# Altium schematic sheet POWER.SchDoc
size A3
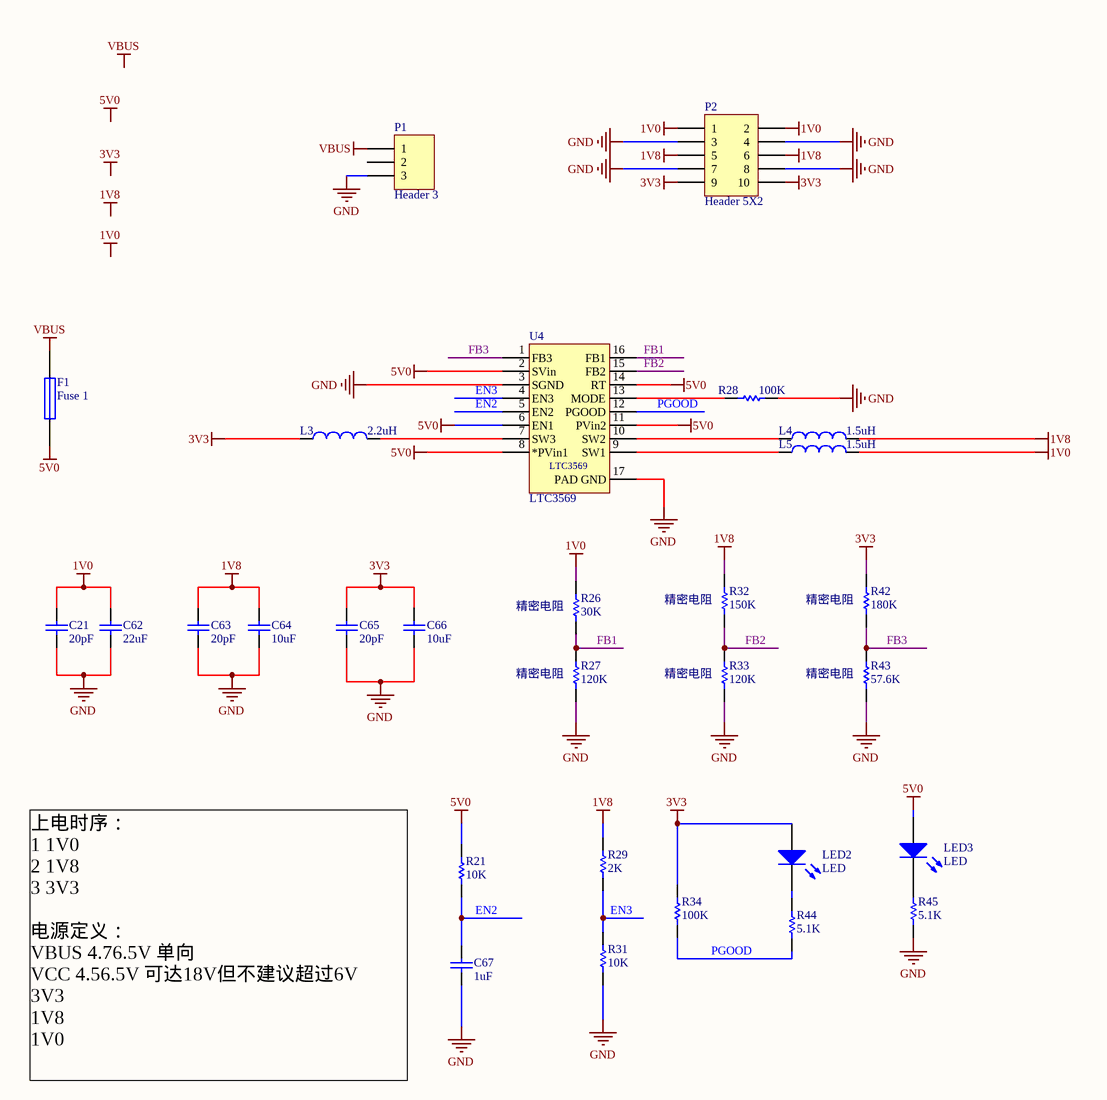
[diagram p0: POWER.SchDoc]

## Parts
C21  value 20pF  [1608[0603]]  (hidden comment: Cap)
C62  value 22uF  [1608[0603]]  (hidden comment: Cap)
C63  value 20pF  [1608[0603]]  (hidden comment: Cap)
C64  value 10uF  [1608[0603]]  (hidden comment: Cap)
C65  value 20pF  [1608[0603]]  (hidden comment: Cap)
C66  value 10uF  [1608[0603]]  (hidden comment: Cap)
C67  value 1uF  [1608[0603]]  (hidden comment: Cap)
F1  Fuse 1  [1206]
L3  value 2.2uH  [C2012]  (hidden comment: Inductor)
L4  value 1.5uH  [C2012]  (hidden comment: Inductor)
L5  value 1.5uH  [C2012]  (hidden comment: Inductor)
LED2  LED  [1608[0603]]
LED3  LED  [1608[0603]]
P1  Header 3  [HDR1X3]
P2  Header 5X2  [HDR2X5]
R21  value 10K  [1608[0603]]
R26  精密电阻  value 30K  [1608[0603]]
R27  精密电阻  value 120K  [1608[0603]]
R28  value 100K  [1608[0603]]
R29  value 2K  [1608[0603]]
R31  value 10K  [1608[0603]]
R32  精密电阻  value 150K  [1608[0603]]
R33  精密电阻  value 120K  [1608[0603]]
R34  value 100K  [1608[0603]]
R42  精密电阻  value 180K  [1608[0603]]
R43  精密电阻  value 57.6K  [1608[0603]]
R44  value 5.1K  [1608[0603]]
R45  value 5.1K  [1608[0603]]
U4  LTC3569  [SOP127P600-8N]

## Nets
1V0: C21.1 C62.1 L5.2 P2.1 P2.2 R26.1
1V8: C63.1 C64.1 L4.2 P2.5 P2.6 R29.1 R32.1
3V3: C65.1 C66.1 L3.1 LED2.1(A) P2.9 P2.10 R34.1 R42.1
5V0: F1.1 LED3.1(A) R21.1 U4.2(SVin) U4.6(EN1) U4.8(*PVin1) U4.11(PVin2) U4.14(RT)
GND: C21.2 C62.2 C63.2 C64.2 C65.2 C66.2 C67.2 P1.3 P2.3 P2.4 P2.7 P2.8 R27.2 R28.1 R31.2 R33.2 R43.2 R45.2 U4.3(SGND) U4.17(PAD_GND)
VBUS: F1.2 P1.1
EN2: C67.1 R21.2 U4.5(EN2)
EN3: R29.2 R31.1 U4.4(EN3)
FB1: R26.2 R27.1 U4.16(FB1)
FB2: R32.2 R33.1 U4.15(FB2)
FB3: R42.2 R43.1 U4.1(FB3)
PGOOD: R34.2 R44.2 U4.12(PGOOD)
NetL3_2: L3.2 U4.7(SW3)
NetL4_1: L4.1 U4.10(SW2)
NetL5_1: L5.1 U4.9(SW1)
NetLED2_2: LED2.2(K) R44.1
NetLED3_2: LED3.2(K) R45.1
NetR28_2: R28.2 U4.13(MODE)

Not connected (* = marked no-connect by the designer): P1 2

## Notes on the sheet
- 上电时序：
  1 1V0
  2 1V8
  3 3V3
  电源定义：
  VBUS 4.76.5V 单向
  VCC 4.56.5V 可达18V但不建议超过6V
  3V3
  1V8
  1V0
- Labels drawn without touching a wire or pin: 1V0, 1V8, 3V3, 5V0, VBUS

## Library data of the parts
C21 C62-C67 = Cap: 贴片电容; Published: 8-Jun-2000; LatestRevisionDate: 17-Jul-2002; LatestRevisionNote: Re-released for DXP Platform.; PackageReference: RAD-0.3; Publisher: Altium Limited
F1 = Fuse 1: Fuse; Published: 8-Jun-2000; LatestRevisionDate: 17-Jul-2002; LatestRevisionNote: Re-released for DXP Platform.; PackageReference: PIN-W2/E2.8; Publisher: Altium Limited; PackageDescription: Thru-Hole; 2 Leads
L3-L5 = Inductor: Code_IEC: 1005; Published: 8-Jun-2000; LatestRevisionDate: 29-May-2009; LatestRevisionNote: IPC-7351 Footprint Added.; PackageReference: 0402-A; Publisher: Altium Limited; PackageDescription: Chip Inductor; Code_JEITA: 0402
P1 = Header 3: Header, 3-Pin; LatestRevisionDate: 17-Jul-2002; LatestRevisionNote: Re-released for DXP Platform.; Publisher: Altium Limited
P2 = Header 5X2: Header, 5-Pin, Dual row; LatestRevisionDate: 17-Jul-2002; LatestRevisionNote: Re-released for DXP Platform.; Publisher: Altium Limited
R21 R26-R29 R31-R34 R42-R45 = Res: 贴片电阻; Published: 8-Jun-2000; LatestRevisionDate: 17-Jul-2002; LatestRevisionNote: Re-released for DXP Platform.; PackageReference: AXIAL-0.3; Publisher: Altium Limited